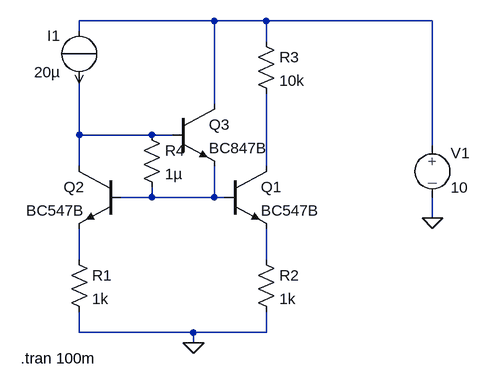
[diagram p0: schematic stromspiegel_n_fach.asc]
stromspiegel_n_fach.asc, the LTspice schematic file:
Version 4
SHEET 1 880 680
WIRE -48 -112 -256 -112
WIRE 32 -112 -48 -112
WIRE 288 -112 32 -112
WIRE -256 -96 -256 -112
WIRE 32 -80 32 -112
WIRE -48 16 -48 -112
WIRE -256 64 -256 -16
WIRE -144 64 -256 64
WIRE -112 64 -144 64
WIRE 288 80 288 -112
WIRE -256 112 -256 64
WIRE 32 112 32 0
WIRE -144 160 -144 144
WIRE -144 160 -192 160
WIRE -48 160 -48 112
WIRE -48 160 -144 160
WIRE -32 160 -48 160
WIRE 288 192 288 160
WIRE -256 256 -256 208
WIRE 32 256 32 208
WIRE -256 368 -256 336
WIRE -80 368 -256 368
WIRE 32 368 32 336
WIRE 32 368 -80 368
WIRE -80 384 -80 368
FLAG -80 384 0
FLAG 288 192 0
SYMBOL EIT_Semiconductors\\npn -32 112 R0
SYMATTR InstName Q1
SYMATTR Value BC547B
SYMBOL EIT_Semiconductors\\npn -192 112 M0
SYMATTR InstName Q2
SYMATTR Value BC547B
SYMBOL res -272 240 R0
SYMATTR InstName R1
SYMATTR Value 1k
SYMBOL res 16 240 R0
SYMATTR InstName R2
SYMATTR Value 1k
SYMBOL source-I -256 -16 R180
WINDOW 0 29 73 Left 0
WINDOW 3 29 17 Left 0
WINDOW 123 0 0 Left 0
WINDOW 39 0 0 Left 0
SYMATTR InstName I1
SYMATTR Value 20µ
SYMBOL source-V 288 64 R0
WINDOW 123 0 0 Left 0
WINDOW 39 0 0 Left 0
SYMATTR InstName V1
SYMATTR Value 10
SYMBOL res 16 -96 R0
SYMATTR InstName R3
SYMATTR Value 10k
SYMBOL EIT_Semiconductors\\npn -112 16 R0
SYMATTR InstName Q3
SYMATTR Value BC847B
SYMBOL res -160 48 R0
SYMATTR InstName R4
SYMATTR Value 1µ
TEXT -346 408 Left 0 !.tran 100m

The netlist it stands for:
* stromspiegel_n_fach.asc
Q1 N003 N004 N006 0 BC547B
Q2 N002 N004 N005 0 BC547B
R1 N005 0 1k
R2 N006 0 1k
I1 N001 N002 20µ
V1 N001 0 10
R3 N001 N003 10k
Q3 N001 N002 N004 0 BC847B
R4 N002 N004 1µ
.model NPN NPN
.model PNP PNP
.lib standard.bjt
.tran 100m
.backanno
.end